# EAGLE design FDUINO (EAGLE 9.3.1)
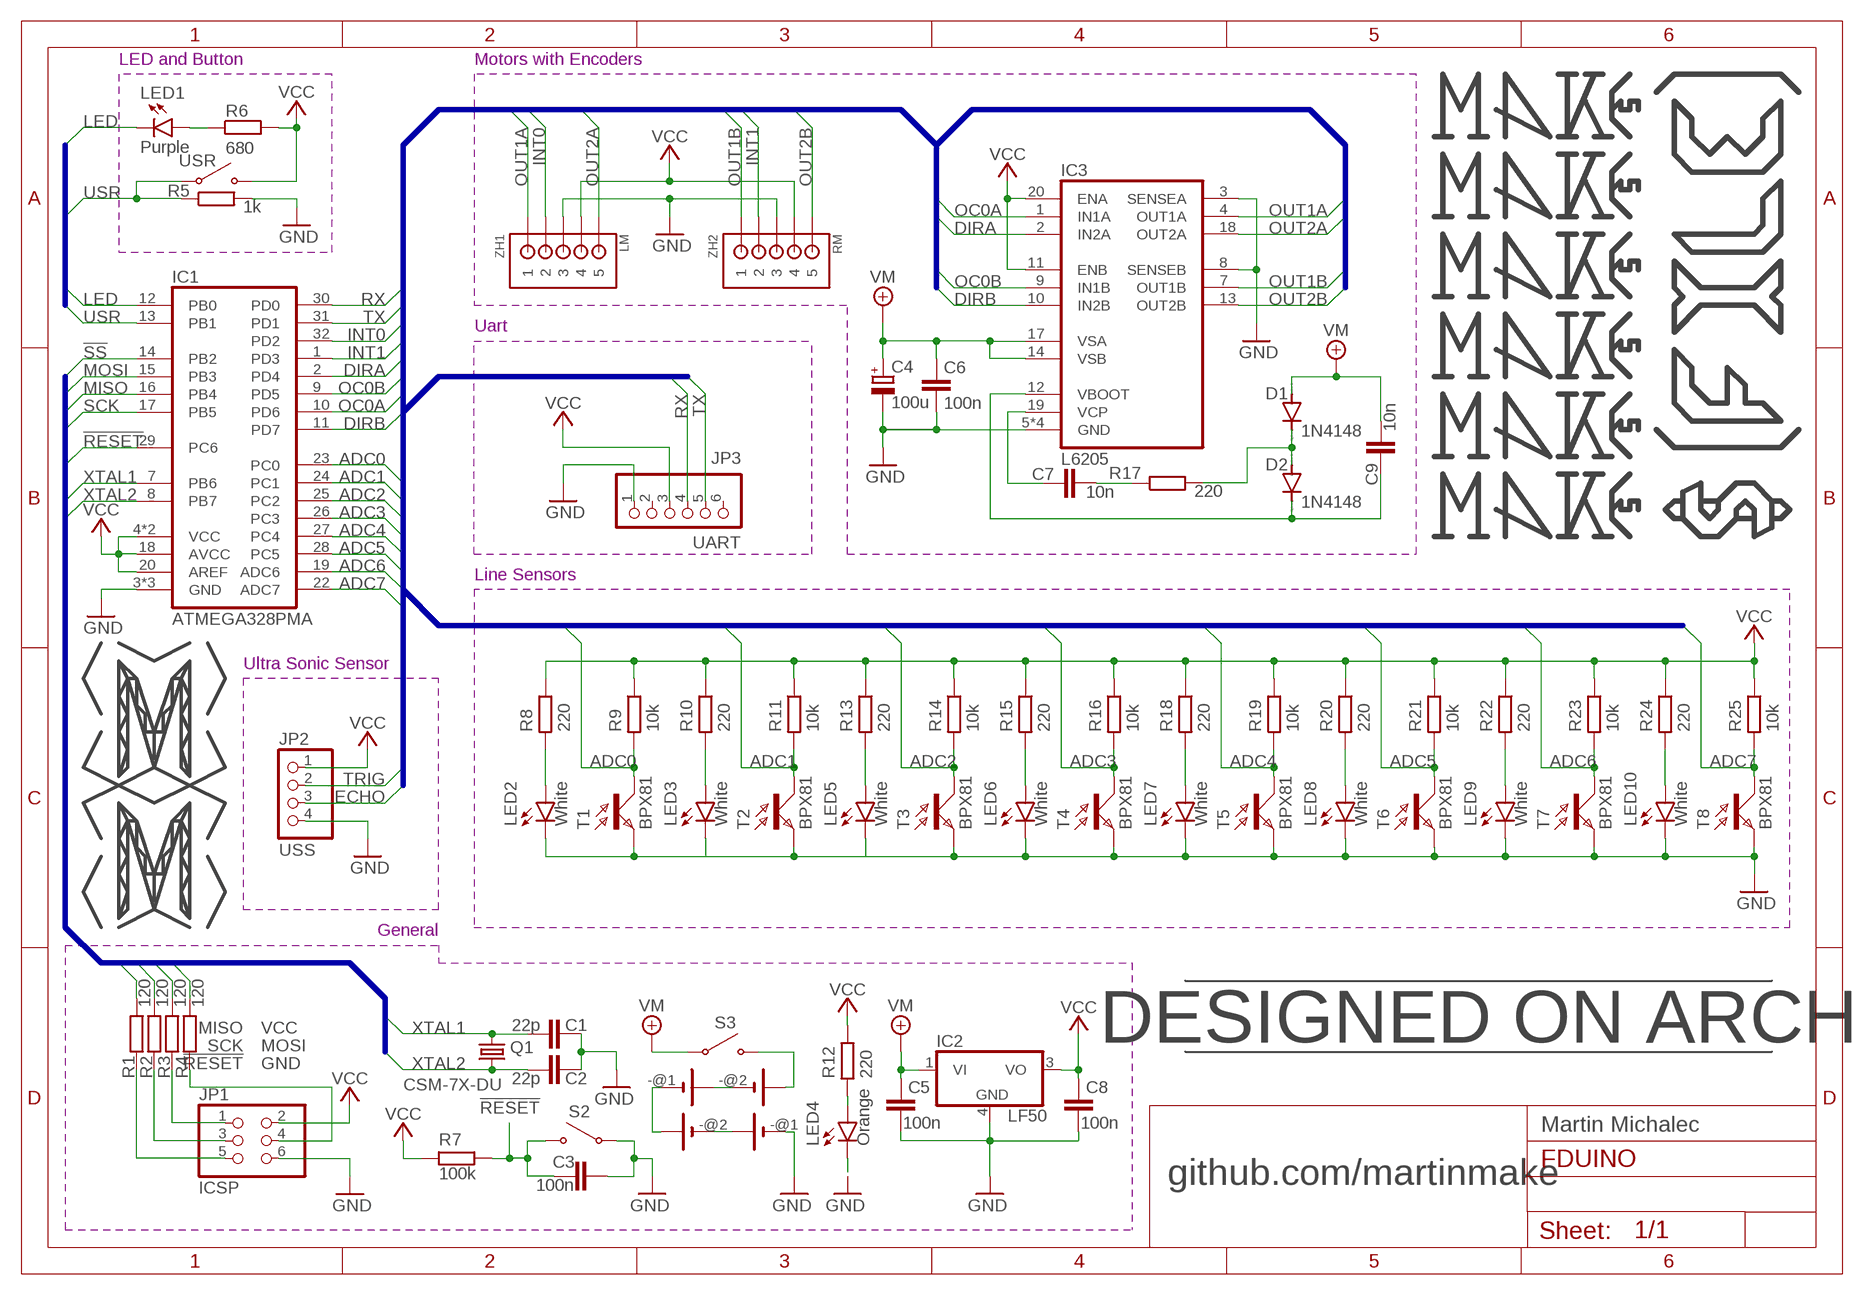
[diagram p0: schematic, sheet 1]

## Parts
BAT1  BATSERIES  [BAT2X18650SERIES]
BAT2  BATSERIES  [BAT2X18650SERIES]
C1  22p  C-EUC1206  [C1206]
C2  22p  C-EUC1206  [C1206]
C3  100n  C-EUC1206  [C1206]
C4  100u  CPOL-EUSMCD  [SMC_D]
C5  100n  C-EUC1206  [C1206]
C6  100n  C-EUC1206  [C1206]
C7  10n  C-EUC1206  [C1206]
C8  100n  C-EUC1206  [C1206]
C9  10n  C-EUC1206  [C1206]
D1  1N4148  1N4148DO35-7  [DO35-7]
D2  1N4148  1N4148DO35-7  [DO35-7]
IC1  ATMEGA328PMA  [TQFP32]
IC2  LF50  LM340MP-05  [SOT223]
IC3  L6205  [SO20]
JP1  ICSP  PINHD-2X3  [2X03]
JP2  USS  PINHD-1X4  [1X04]
JP3  UART  PINHD-1X6/90  [1X06/90]
LED1  Purple  LEDSML1206  [SML1206]
LED2  White  LEDSML1206  [SML1206]
LED3  White  LEDSML1206  [SML1206]
LED4  Orange  LEDSML1206  [SML1206]
LED5  White  LEDSML1206  [SML1206]
LED6  White  LEDSML1206  [SML1206]
LED7  White  LEDSML1206  [SML1206]
LED8  White  LEDSML1206  [SML1206]
LED9  White  LEDSML1206  [SML1206]
LED10  White  LEDSML1206  [SML1206]
Q1  CSM-7X-DU  [CSM-7X-DU]
R1  120  R-EU_R1206  [R1206]
R2  120  R-EU_R1206  [R1206]
R3  120  R-EU_R1206  [R1206]
R4  120  R-EU_R1206  [R1206]
R5  1k  R-EU_R1206  [R1206]
R6  680  R-EU_R1206  [R1206]
R7  100k  R-EU_R1206  [R1206]
R8  220  R-EU_R1206  [R1206]
R9  10k  R-EU_R1206  [R1206]
R10  220  R-EU_R1206  [R1206]
R11  10k  R-EU_R1206  [R1206]
R12  220  R-EU_R1206  [R1206]
R13  220  R-EU_R1206  [R1206]
R14  10k  R-EU_R1206  [R1206]
R15  220  R-EU_R1206  [R1206]
R16  10k  R-EU_R1206  [R1206]
R17  220  R-EU_R1206  [R1206]
R18  220  R-EU_R1206  [R1206]
R19  10k  R-EU_R1206  [R1206]
R20  220  R-EU_R1206  [R1206]
R21  10k  R-EU_R1206  [R1206]
R22  220  R-EU_R1206  [R1206]
R23  10k  R-EU_R1206  [R1206]
R24  220  R-EU_R1206  [R1206]
R25  10k  R-EU_R1206  [R1206]
S2  SWITCHTHT  [SWITCH]
S3  SWITCHTHT  [SWITCH]
T1  BPX81  [BPX81]
T2  BPX81  [BPX81]
T3  BPX81  [BPX81]
T4  BPX81  [BPX81]
T5  BPX81  [BPX81]
T6  BPX81  [BPX81]
T7  BPX81  [BPX81]
T8  BPX81  [BPX81]
USR  SWITCHTHT  [SWITCH]
ZH1  LM  B5B-ZR  [B5B-ZR]
ZH2  RM  B5B-ZR  [B5B-ZR]

## Nets
!RESET: C3.1 IC1.29(PC6) R1.2 R7.2 S2.P$2
!SS: IC1.14(PB2)
ADC0: IC1.23(PC0) R9.2 T1.C
ADC1: IC1.24(PC1) R11.2 T2.C
ADC2: IC1.25(PC2) R14.2 T3.C
ADC3: IC1.26(PC3) R16.2 T4.C
ADC4: IC1.27(PC4) R19.2 T5.C
ADC5: IC1.28(PC5) R21.2 T6.C
ADC6: IC1.19(ADC6) R23.2 T7.C
ADC7: IC1.22(ADC7) R25.2 T8.C
DIRA: IC1.2(PD4) IC3.2(IN2A)
DIRB: IC1.11(PD7) IC3.10(IN2B)
ECHO: JP2.3
GND: BAT2.-@1(A:-) C1.1 C2.1 C3.2 C4.- C5.2 C6.2 C8.2 IC1.3(GND) IC1.5(GND) IC1.21(GND) IC2.4(GND) IC3.3(SENSEA) IC3.5(GND) IC3.6(GND) IC3.8(SENSEB) IC3.15(GND) IC3.16(GND) JP1.6 JP2.4 JP3.1 LED4.C R5.2 S2.P$1 ZH1.3 ZH2.3
GND2: LED2.C LED3.C LED5.C LED6.C LED7.C LED8.C LED9.C LED10.C T1.E T2.E T3.E T4.E T5.E T6.E T7.E T8.E ; supply symbol labelled GND
INT0: IC1.32(PD2) ZH1.2
INT1: IC1.1(PD3) ZH2.2
LED: IC1.12(PB0) LED1.C
MISO: IC1.16(PB4) R3.2
MOSI: IC1.15(PB3) R4.2
N$1: LED5.A R13.2
N$2: C9.1 D2.C IC3.12(VBOOT)
N$3: D1.C D2.A R17.2
N$4: C7.2 R17.1
N$5: LED1.A R6.1
N$7: C7.1 IC3.19(VCP)
N$9: BAT2.+@1(A:+) BAT2.-@2(B:-)
N$10: BAT1.+@1(A:+) BAT1.-@2(B:-)
N$12: LED6.A R15.2
N$14: BAT1.+@2(B:+) S3.P$2
N$15: BAT1.-@1(A:-) BAT2.+@2(B:+)
N$22: LED10.A R24.2
N$23: LED7.A R18.2
N$24: R15.1
N$27: LED8.A R20.2
N$28: R18.1
N$30: LED9.A R22.2
N$32: R13.1
N$33: JP1.1 R3.1
N$35: R20.1
N$36: LED4.A R12.2
N$38: R22.1
N$40: R10.1
N$41: R24.1
N$43: LED3.A R10.2
N$45: R8.1
N$47: LED2.A R8.2
N$49: JP1.3 R2.1
N$50: JP1.5 R1.1
N$51: JP1.4 R4.1
OC0A: IC1.10(PD6) IC3.1(IN1A)
OC0B: IC1.9(PD5) IC3.9(IN1B)
OUT1A: IC3.4(OUT1A) ZH1.1
OUT1B: IC3.7(OUT1B) ZH2.1
OUT2A: IC3.18(OUT2A) ZH1.5
OUT2B: IC3.13(OUT2B) ZH2.5
RX: IC1.30(PD0) JP3.4
SCK: IC1.17(PB5) R2.2
TRIG: JP2.2
TX: IC1.31(PD1) JP3.5
USR: IC1.13(PB1) R5.1 USR.P$1
VCC: C8.1 IC1.4(VCC) IC1.6(VCC) IC1.18(AVCC) IC1.20(AREF) IC2.3(VO) IC3.11(ENB) IC3.20(ENA) JP1.2 JP2.1 JP3.3 R6.2 R7.1 R9.1 R11.1 R12.1 R14.1 R16.1 R19.1 R21.1 R23.1 R25.1 USR.P$2 ZH1.4 ZH2.4
VM: C4.+ C5.1 C6.1 C9.2 D1.A IC2.1(VI) IC3.14(VSB) IC3.17(VSA) S3.P$1
XTAL1: C1.2 IC1.7(PB6) Q1.2
XTAL2: C2.2 IC1.8(PB7) Q1.1
Unconnected: JP3.2 JP3.6

## Buses
MISO,MOSI,MOSIR,!RESET,SCK,!SS,XTAL1,XTAL2
ADC0,ADC1,ADC2,ADC3,ADC4,ADC5,ADC6,ADC7,DIRA,DIRB,ECHO,INT0,INT1,OC0A,OC0B,OUT1A,OUT1B,OUT2A,OUT2B,RX,TRIG,TX
LED,PB1,USR

## Notes on the sheet
- LED and Button | Motors with Encoders
- Uart
- Line Sensors
- Ultra Sonic Sensor
- General
- DESIGNED ON ARCH
- Martin Michalec
- github.com/martinmake

## Library data of the parts
BAT1 BAT2 = martinmake:BAT: LI BATTERY Varta
C1-C3 C5-C9 = rcl:C-EU: CAPACITOR, European symbol; SPICEPREFIX: C
C4 = rcl:CPOL-EU: POLARIZED CAPACITOR, European symbol; SPICEPREFIX: C
D1 D2 = diode:1N4148: DIODE high speed (Philips)
IC1 = martinmake:ATMEGA328P: 32A, 32-lead, 7 x 7 mm Body Size, 1.0 mm Body Thickness, 0.8 mm Lead Pitch, Thin Profile Plastic Quad Flat Package (TQFP)
IC2 = linear:LM340?-*: Positive VOLTAGE REGULATOR Source: http://cache.national.com/ds/LM/LM340.pdf
IC3 = martinmake:L6205
JP1 = pinhead:PINHD-2X3: PIN HEADER
JP2 = pinhead:PINHD-1X4: PIN HEADER
JP3 = pinhead:PINHD-1X6: PIN HEADER
LED1-LED10 = led:LED: LED OSRAM: - CHIPLED LG R971, LG N971, LY N971, LG Q971, LY Q971, LO R971, LY R971 LH N974, LH R974 LS Q976, LO Q976, LY Q976 LO Q996 - Hyper CHIPLED LW Q18S LB Q993, LB Q99A, LB R99A - SideLED LS A670, LO A670, LY A670, LG A670, LP A670 LB A673, LV A673, LT A673, LW A673 LH A674 LY A675 LS A676, LA A676, LO A676, LY A676, LW A676 LS A679, LY A679, LG A679 - Hyper Micro SIDELED® LS Y876, LA Y876, LO Y876, LY Y876 LT Y87S - SmartLED LW L88C, LW L88S LB L89C, LB L89S, LG L890 LS L89K, LO L89K, LY L89K LS L896, LA L896, LO L896, LY L896 - TOPLED LS T670, LO T670, LY T670, LG T670, LP T670 LSG T670, LSP T670, LSY T670, LOP T670, LYG T670 LG T671, LOG T671, LSG T671 LB T673, LV T673, LT T673, LW T673 LH T674 LS T676, LA T676, LO T676, LY T676, LB T676, LH T676, LSB T676, LW T676 LB T67C, LV T67C, LT T67C, LS T67K, LO T67K, LY T67K, LW E67C LS E67B, LA E67B, LO E67B, LY E67B, LB E67C, LV E67C, LT E67C LW T67C LS T679, LY T679, LG T679 LS T770, LO T770, LY T770, LG T770, LP T770 LB T773, LV T773, LT T773, LW T773 LH T774 LS E675, LA E675, LY E675, LS T675 LS T776, LA T776, LO T776, LY T776, LB T776 LHGB T686 LT T68C, LB T68C - Hyper Mini TOPLED® LB M676 - Mini TOPLED Santana® LG M470 LS M47K, LO M47K, LY M47K Source: http://www.osram.convergy.de LUXEON: - LUMILED® LXK2-PW12-R00, LXK2-PW12-S00, LXK2-PW14-U00, LXK2-PW14-V00 LXK2-PM12-R00, LXK2-PM12-S00, LXK2-PM14-U00 LXK2-PE12-Q00, LXK2-PE12-R00, LXK2-PE12-S00, LXK2-PE14-T00, LXK2-PE14-U00 LXK2-PB12-K00, LXK2-PB12-L00, LXK2-PB12-M00, LXK2-PB14-N00, LXK2-PB14-P00, LXK2-PB14-Q00 LXK2-PR12-L00, LXK2-PR12-M00, LXK2-PR14-Q00, LXK2-PR14-R00 LXK2-PD12-Q00, LXK2-PD12-R00, LXK2-PD12-S00 LXK2-PH12-R00, LXK2-PH12-S00 LXK2-PL12-P00, LXK2-PL12-Q00, LXK2-PL12-R00 Source: www.luxeon.com KINGBRIGHT: KA-3528ASYC Source: www.kingbright.com
Q1 = crystal:CSM-7X-DU: SMD CRYSTAL Source: www.ecsxtal.com .. Crystal 3.6864MHz CSM_7X_DU.PDF; OC_FARNELL: unknown; OC_NEWARK: unknown
R1-R25 = rcl:R-EU_: RESISTOR, European symbol; SPICEPREFIX: R
S2 S3 USR = martinmake:SWITCH
T1-T8 = opto-trans-siemens:BPX81: PHOTO TRANSISTOR; OC_FARNELL: unknown; OC_NEWARK: unknown
ZH1 ZH2 = jst:B5B-ZR: JST-ZH Connector 5 pol, 1.5mm pitch Package: B5B-ZR Source: http://www.jst-mfg.com/product/pdf/eng/eZH.pdf

## Board
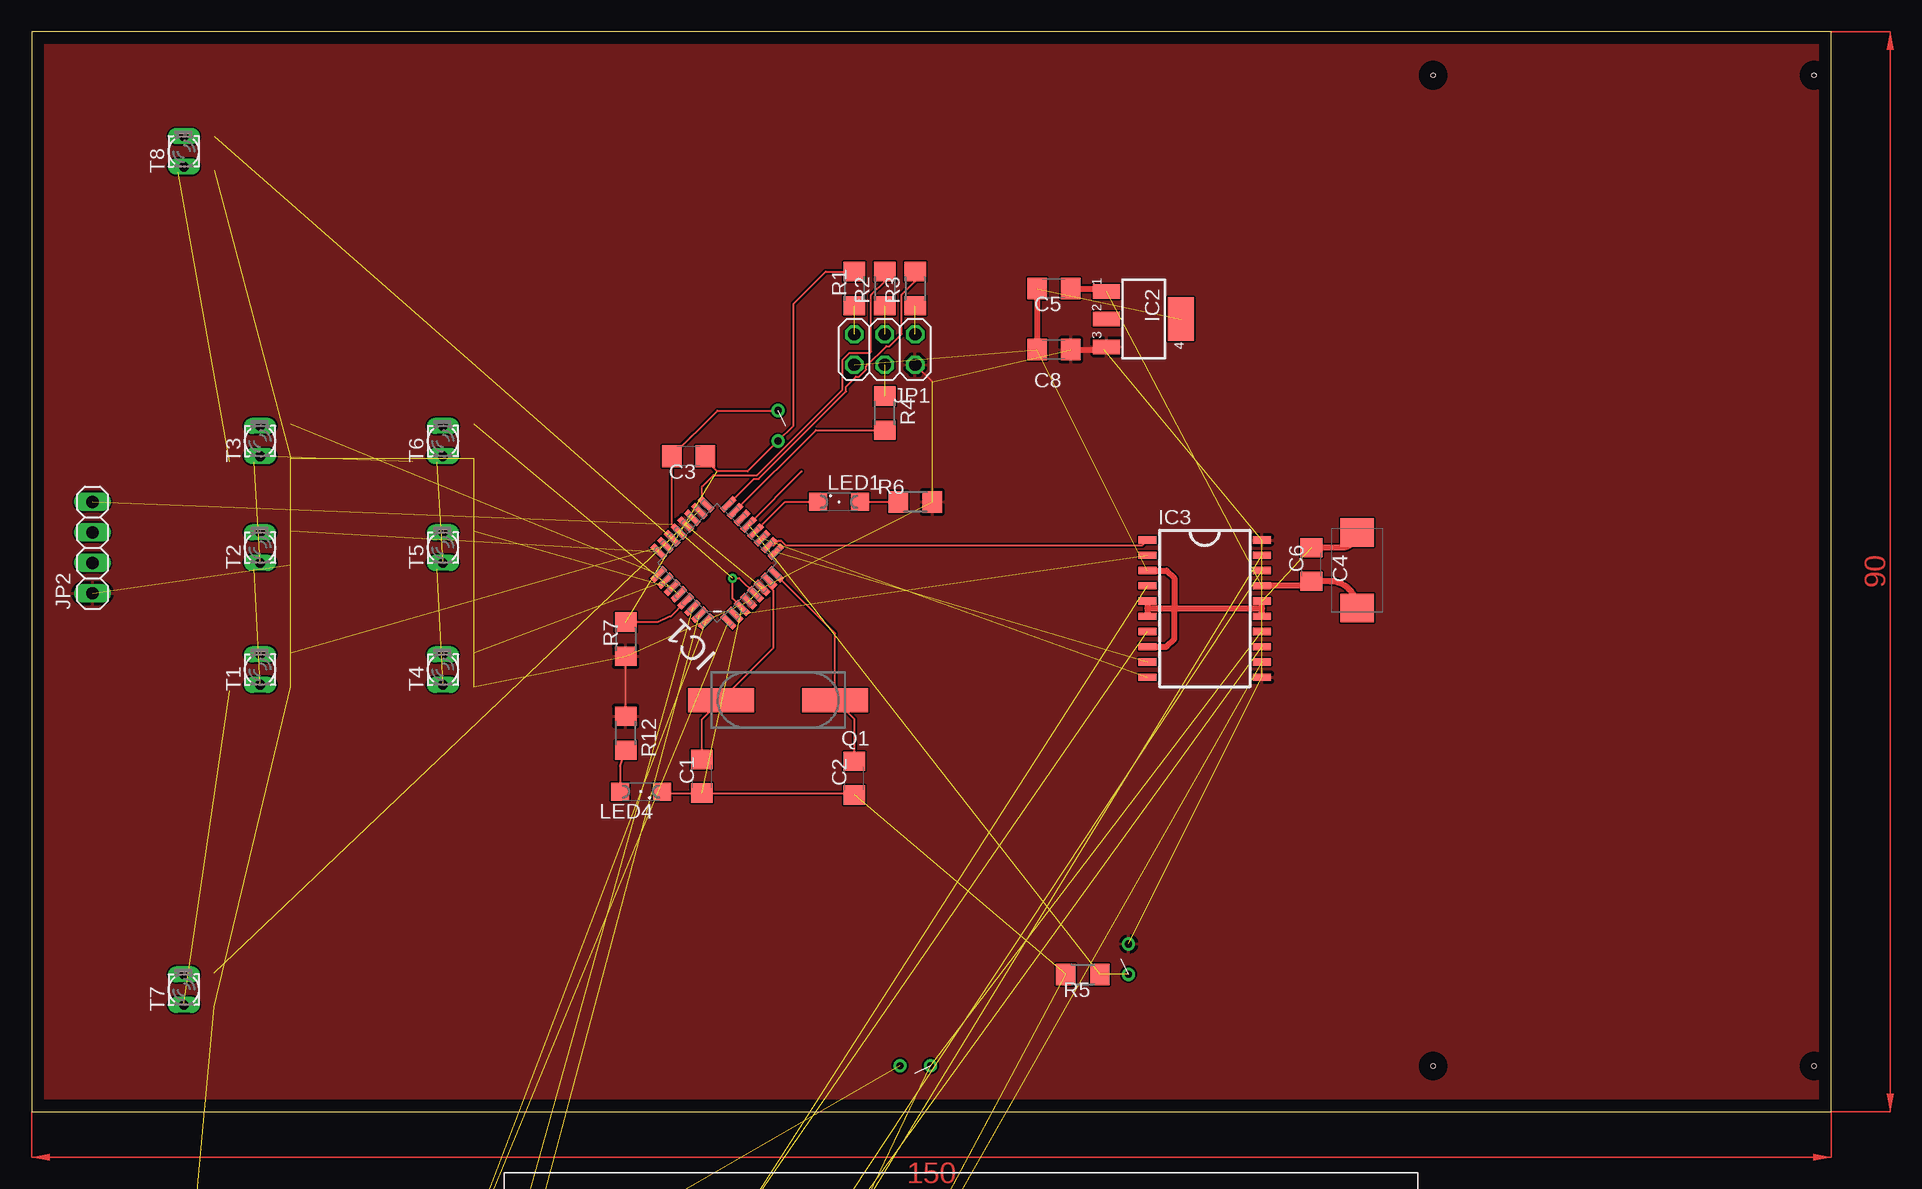
[diagram p1: board, top side]
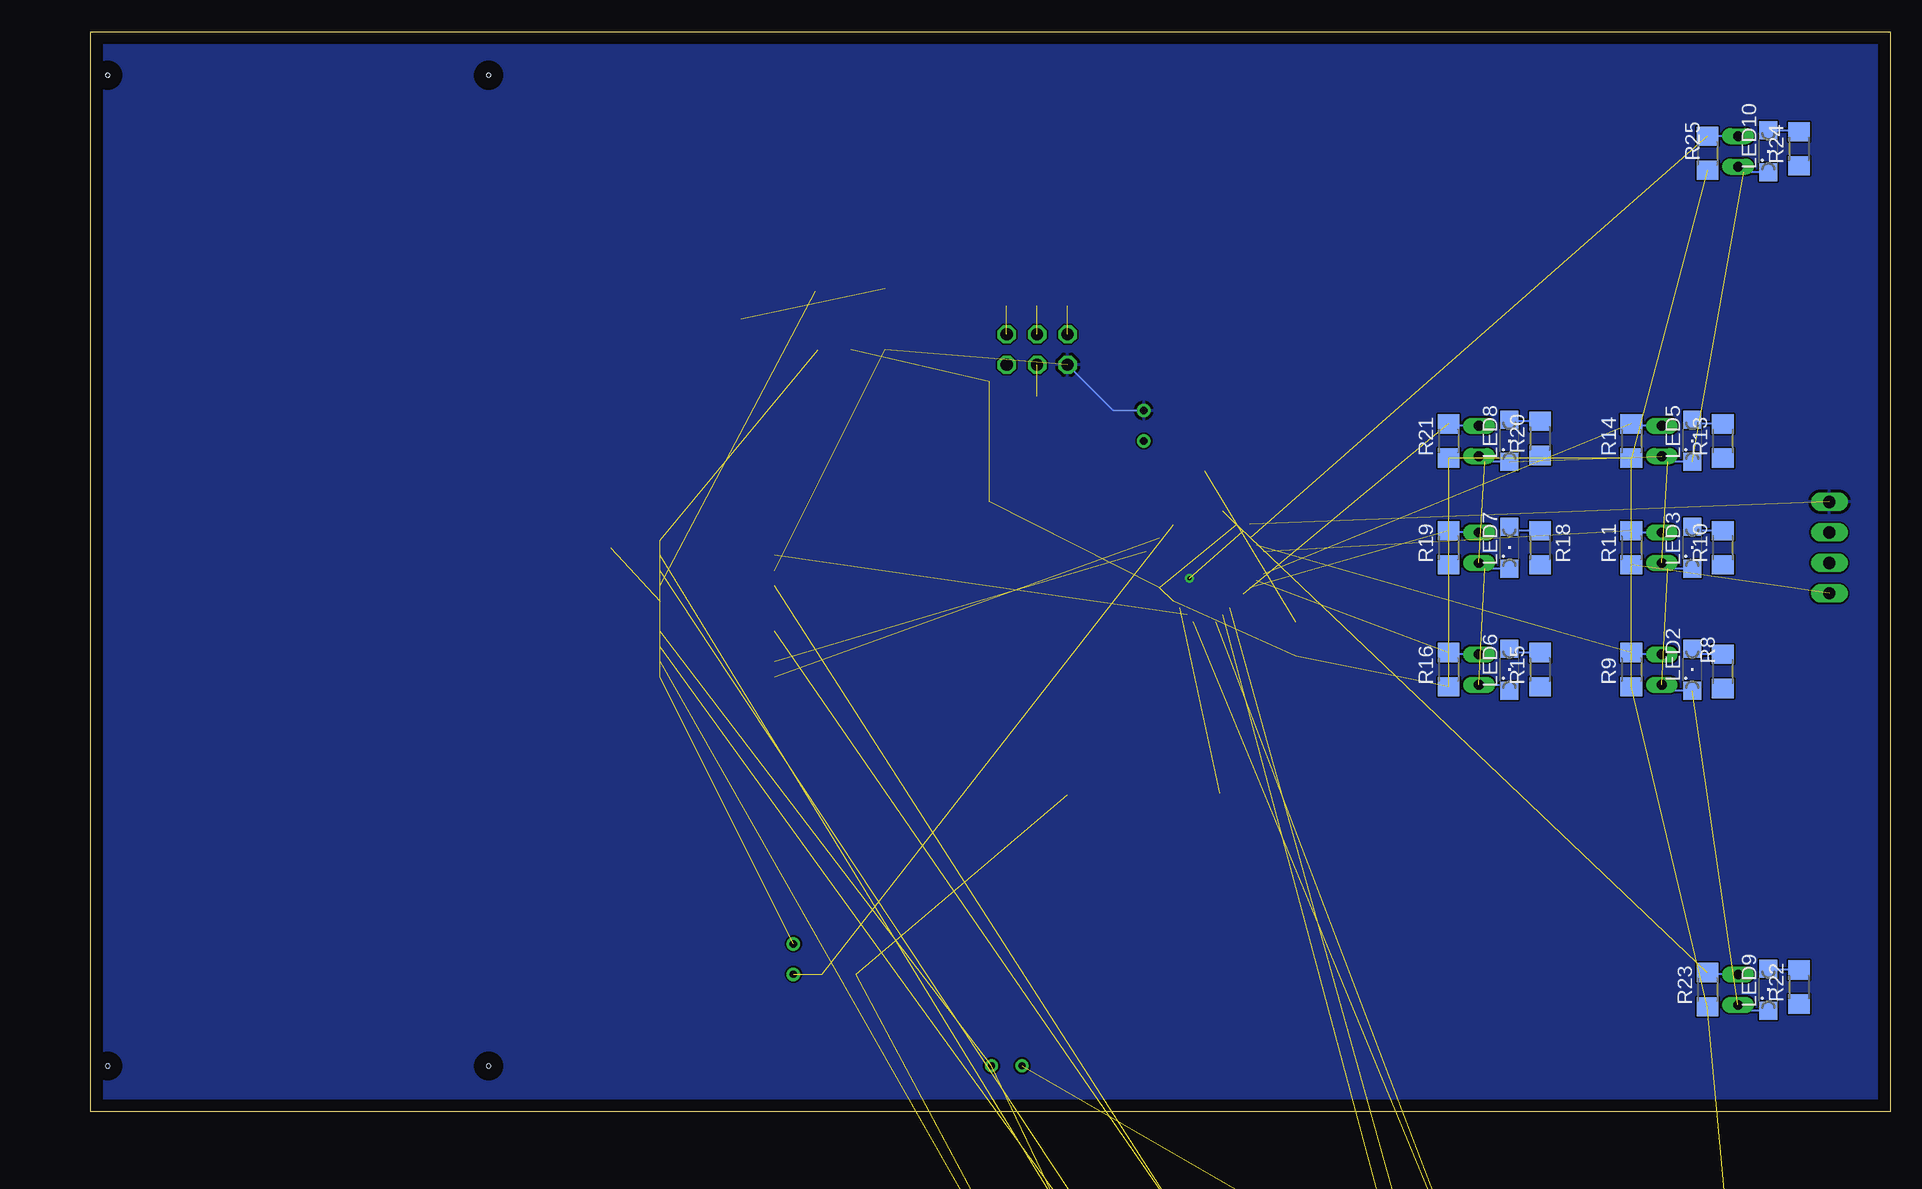
[diagram p2: board, bottom side, seen from below]

Size 150 x 90 mm. Coordinates in mm from the lower left corner, seen from the top.
Outline: 0,0 150,0 150,90 0,90 0,0
Copper layers (1*16): Top 0.035mm / dielectric 1.5mm / Bottom 0.035mm
Design rules "default": minimum track width 6mil, minimum drill 0.35mm, track to track 6mil, track to pad 6mil, pad to pad 6mil, via to via 6mil, smd to smd 6mil, copper to edge 40mil, drill to drill 6mil, minimum pad ring 10mil, minimum via ring 8mil, stop-mask expansion 4mil, vias tented up to drill 0mil, thermal gap 10mil
Holes 0.35 mm at 116.84,3.81 148.59,3.81 116.84,86.36 148.59,86.36

### Footprints (pad centres in the part's own frame; a part is rotated, then mirrored left to right if it is on the bottom)
BAT2X18650SERIES = drill 1.6 pad 3: +@1 -36.83,10.16; +@2 39.37,-8.89; -@1 39.37,10.16; -@2 -36.83,-8.89 | hole 3: 30.48,-8.89; -25.4,-8.89; -27.94,10.16; 27.94,10.16
C1206 = smd 1.6 x 1.8: 1 -1.4,0; 2 1.4,0
SMC_D = smd 2.4 x 2.8: + -3.15,0; - 3.15,0
DO35-7 = drill 0.813 long: A 3.81,0; C -3.81,0
TQFP32 = smd 1.473 x 0.508: 1 -4.115,2.794; 2 -4.115,2.007; 3 -4.115,1.194; 4 -4.115,0.406; 5 -4.115,-0.406; 6 -4.115,-1.194; 7 -4.115,-2.007; 8 -4.115,-2.794; 17 4.115,-2.794; 18 4.115,-2.007; 19 4.115,-1.194; 20 4.115,-0.406; 21 4.115,0.406; 22 4.115,1.194; 23 4.115,2.007; 24 4.115,2.794 | smd 0.508 x 1.473: 9 -2.794,-4.115; 10 -2.007,-4.115; 11 -1.194,-4.115; 12 -0.406,-4.115; 13 0.406,-4.115; 14 1.194,-4.115; 15 2.007,-4.115; 16 2.794,-4.115; 25 2.794,4.115; 26 2.007,4.115; 27 1.194,4.115; 28 0.406,4.115; 29 -0.406,4.115; 30 -1.194,4.115; 31 -2.007,4.115; 32 -2.794,4.115
SOT223 = smd 1.219 x 2.235: 1 -2.311,-3.099; 2 0,-3.099; 3 2.311,-3.099 | smd 3.6 x 2.2: 4 0,3.099
SO20 = smd 0.6 x 1.5: 1 -5.715,-4.78; 2 -4.445,-4.78; 3 -3.175,-4.78; 4 -1.905,-4.78; 5 -0.635,-4.78; 6 0.635,-4.78; 7 1.905,-4.78; 8 3.175,-4.78; 9 4.445,-4.78; 10 5.715,-4.78; 11 5.715,4.78; 12 4.445,4.78; 13 3.175,4.78; 14 1.905,4.78; 15 0.635,4.78; 16 -0.635,4.78; 17 -1.905,4.78; 18 -3.175,4.78; 19 -4.445,4.78; 20 -5.715,4.78
2X03 = drill 1.016 octagon: 1 -2.54,-1.27; 2 -2.54,1.27; 3 0,-1.27; 4 0,1.27; 5 2.54,-1.27; 6 2.54,1.27
1X04 = drill 1.016 long: 1 -3.81,0; 2 -1.27,0; 3 1.27,0; 4 3.81,0
1X06/90 = drill 1.016 long: 1 -6.35,-3.81; 2 -3.81,-3.81; 3 -1.27,-3.81; 4 1.27,-3.81; 5 3.81,-3.81; 6 6.35,-3.81
SML1206 = smd 1.5 x 1.5: A 1.75,0; C -1.75,0
CSM-7X-DU = smd 5.5 x 2: 1 -4.75,0; 2 4.75,0
R1206 = smd 1.6 x 1.803: 1 -1.422,0; 2 1.422,0
SWITCH = drill 0.6: P$1 -1.27,0; P$2 1.27,0
BPX81 = drill 0.813 long: C 1.27,0; E -1.27,0
B5B-ZR = drill 0.7: 1 7.5,-1.3; 2 6,-1.3; 3 4.5,-1.3; 4 3,-1.3; 5 1.5,-1.3

### Placement (x,y rotation side)
BAT1  78.74,-24.13 180 top  (outside the outline)
BAT2  78.74,-66.04 180 top  (outside the outline)
C1  55.88,27.94 90 top
C2  68.58,27.79 90 top
C3  54.76,54.61 180 top
C4  110.49,45.11 90 top
C5  85.22,68.58 180 top
C6  106.68,45.59 90 top
C7  2.54,-119.38 0 top  (outside the outline)
C8  85.22,63.5 180 top
C9  2.54,-144.78 0 top  (outside the outline)
D1  6.35,-132.08 0 top  (outside the outline)
D2  6.35,-138.43 0 top  (outside the outline)
IC1  57.15,45.72 135 top
IC2  92.71,66.04 270 top
IC3  97.79,41.91 270 top
JP1  71.12,63.5 180 top
JP2  5.08,46.99 90 top
JP3  10.16,-110.49 0 top  (outside the outline)
LED1  67.31,50.8 0 top
LED2  16.51,36.83 90 bottom
LED3  16.51,46.99 90 bottom
LED4  50.8,26.67 180 top
LED5  16.51,55.88 90 bottom
LED6  31.75,36.83 90 bottom
LED7  31.75,46.99 90 bottom
LED8  31.75,55.88 90 bottom
LED9  10.16,10.16 90 bottom
LED10  10.16,80.01 90 bottom
Q1  62.23,34.29 180 top
R1  68.58,68.58 90 top
R2  71.12,68.58 90 top
R3  73.66,68.58 90 top
R4  71.12,58.2 270 top
R5  87.63,11.43 180 top
R6  73.66,50.8 0 top
R7  49.53,39.37 90 top
R8  13.97,36.68 90 bottom
R9  21.59,36.83 90 bottom
R10  13.97,46.99 90 bottom
R11  21.59,46.99 90 bottom
R12  49.53,31.53 270 top
R13  13.97,55.88 90 bottom
R14  21.59,55.88 90 bottom
R15  29.21,36.83 90 bottom
R16  36.83,36.83 90 bottom
R17  2.54,-125.73 0 top  (outside the outline)
R18  29.21,46.99 90 bottom
R19  36.83,46.99 90 bottom
R20  29.21,56.1 90 bottom
R21  36.83,55.88 90 bottom
R22  7.62,10.38 90 bottom
R23  15.24,10.16 90 bottom
R24  7.62,80.23 90 bottom
R25  15.24,79.86 90 bottom
S2  62.23,57.15 270 top
S3  73.66,3.81 180 top
T1  19.05,36.83 90 top
T2  19.05,46.99 90 top
T3  19.05,55.88 90 top
T4  34.29,36.83 90 top
T5  34.29,46.99 90 top
T6  34.29,55.88 90 top
T7  12.7,10.16 90 top
T8  12.7,80.01 90 top
USR  91.44,12.7 90 top
ZH1  8.89,-100.33 180 top  (outside the outline)
ZH2  8.89,-93.98 180 top  (outside the outline)

### Tracks (layer width: path | path; a pad name or v marks a point on that pad's centre or on a via)
!RESET  (1 unrouted)
  Top 0.152: IC1.29 53.26,41.25 53.15,41.25 52.18,40.79 R7.2 | C3.1 56.16,54.33 57.15,53.34 59.69,53.34 S2.P$2 63.5,57.15 63.5,67.31 66.19,70 R1.2
ADC0  (1 unrouted)
  Bottom 0.152: T1.C 21.44,38.1 R9.2
ADC1  (1 unrouted)
  Bottom 0.152: R11.2 21.44,48.26 T2.C
ADC2  (1 unrouted)
  Bottom 0.152: T3.C 21.44,57.15 R14.2
ADC3  (1 unrouted)
  Bottom 0.152: T4.C 36.68,38.1 R16.2
ADC4  (1 unrouted)
  Bottom 0.152: T5.C 36.68,48.26 R19.2
ADC5  (1 unrouted)
  Bottom 0.152: T6.C 36.68,57.15 R21.2
ADC6  (1 unrouted)
  Bottom 0.152: T7.C 15.09,11.43 R23.2
ADC7  (1 unrouted)
  Bottom 0.152: T8.C R25.2
DIRA  (1 unrouted)
DIRB  (1 unrouted)
GND  (via drill 0.35)  (12 unrouted)
  Top 0.152: IC1.5 | IC1.3 58.42,42.76 v58.42,44.45 58.99,44.45 IC1.5 | C2.1 68.43,26.54 C1.1 52.68,26.54 LED4.C | IC1.21 53.36,48.93 C3.2 57.17,58.42 S2.P$1
  Top 0.5: C4.- arc-90 109.22,46.99 C6.2 | C5.2 C8.2 | IC3.5 93.01,41.91 | 93.01,41.91 IC3.6 | IC3.15 102.57,41.91 | 102.57,41.91 IC3.16 | 102.57,41.91 95.25,41.91 | 95.25,41.91 93.01,41.91 | IC3.3 94.61,45.09 95.25,44.45 95.25,41.91 | IC3.8 94.61,38.73 95.25,39.37 95.25,41.91
  Bottom 0.152: S2.P$1 64.77,58.42 JP1.6
  pour Bottom: 0,0 150,0 150,90 0,90
GND2  (7 unrouted)
  Bottom 0.152: LED3.C 18.57,45.24 T2.E | LED5.C 18.57,54.13 T3.E | LED10.C 12.22,78.26 T8.E | LED8.C 33.81,54.13 T6.E | LED7.C 33.81,45.24 T5.E | LED2.C 18.57,35.08 T1.E | T4.E 32.23,35.56 LED6.C | LED9.C 12.22,8.41 T7.E
INT0  (1 unrouted)
INT1  (1 unrouted)
LED
  Top 0.152: IC1.12 62.8,50.8 LED1.C
MISO
  Top 0.152: R3.2 73.66,69.18 72.53,68.05 72.53,64.78 71.53,63.78 71.26,63.78 69.57,62.09 69.57,61.82 68.99,61.24 68.72,61.24 67.89,60.42 67.89,60.01 60.62,52.73 60.21,52.73 IC1.16
MOSI
  Top 0.152: IC1.15 65.37,56.78 R4.2
N$1
  Bottom 0.152: R13.2 16.18,57.3 LED5.A
N$2  (2 unrouted)
N$3  (2 unrouted)
N$4  (1 unrouted)
N$5
  Top 0.152: LED1.A R6.1
N$7  (1 unrouted)
N$9  (1 unrouted)
N$10  (1 unrouted)
N$12
  Bottom 0.152: R15.2 31.42,38.25 LED6.A
N$14  (1 unrouted)
N$15  (1 unrouted)
N$22
  Bottom 0.152: LED10.A 7.73,81.76 R24.2
N$23
  Bottom 0.152: R18.2 31.42,48.41 LED7.A
N$27
  Bottom 0.152: R20.2 31.64,57.52 LED8.A
N$30
  Bottom 0.152: R22.2 10.05,11.8 LED9.A
N$33  (1 unrouted)
N$36
  Top 0.152: LED4.A 49.05,28.79 R12.2
N$43
  Bottom 0.152: R10.2 16.18,48.41 LED3.A
N$47
  Bottom 0.152: R8.2 16.03,38.1 LED2.A
N$49  (1 unrouted)
N$50  (1 unrouted)
N$51  (1 unrouted)
OC0A
  Top 0.152: IC3.1 92.6,47.21 62.84,47.21 62.47,47.58 62.28,47.58 61.91,47.21 IC1.10
OC0B  (1 unrouted)
OUT1A  (1 unrouted)
OUT1B  (1 unrouted)
OUT2A  (1 unrouted)
OUT2B  (1 unrouted)
RX  (1 unrouted)
SCK
  Top 0.152: IC1.17 55.88,50.94 55.88,52.07 56.84,53.03 60.49,53.03 67.59,60.13 67.59,62.64 68.17,63.22 69.88,63.22 69.99,63.34 69.99,68.05 71.12,69.18 R2.2 70.61,70
TX  (1 unrouted)
USR  (2 unrouted)
  Top 0.152: IC1.13 64.19,53.34
VCC  (22 unrouted)
  Top 0.152: R12.1 R7.1 | 75.08,60.81 JP1.2
  Top 0.5: C8.1 89.38,63.5 IC2.3
  pour Top: 0,90 150,90 150,0 0,0
VM  (5 unrouted)
  Top 0.152: 89.38,68.58 IC2.1
  Top 0.5: C4.+ arc90 108.26,44.19 C6.1 arc-90 106.31,43.81 IC3.17 | C5.1 89.38,68.58
XTAL1
  Top 0.152: C1.2 55.88,32.69 Q1.2 61.83,38.64 61.83,43.41 61.48,43.76 IC1.7
XTAL2
  Top 0.152: C2.2 68.58,32.69 Q1.1 66.98,39.84 IC1.8
(copper drawn outside any net)
  shapes: Top area x2